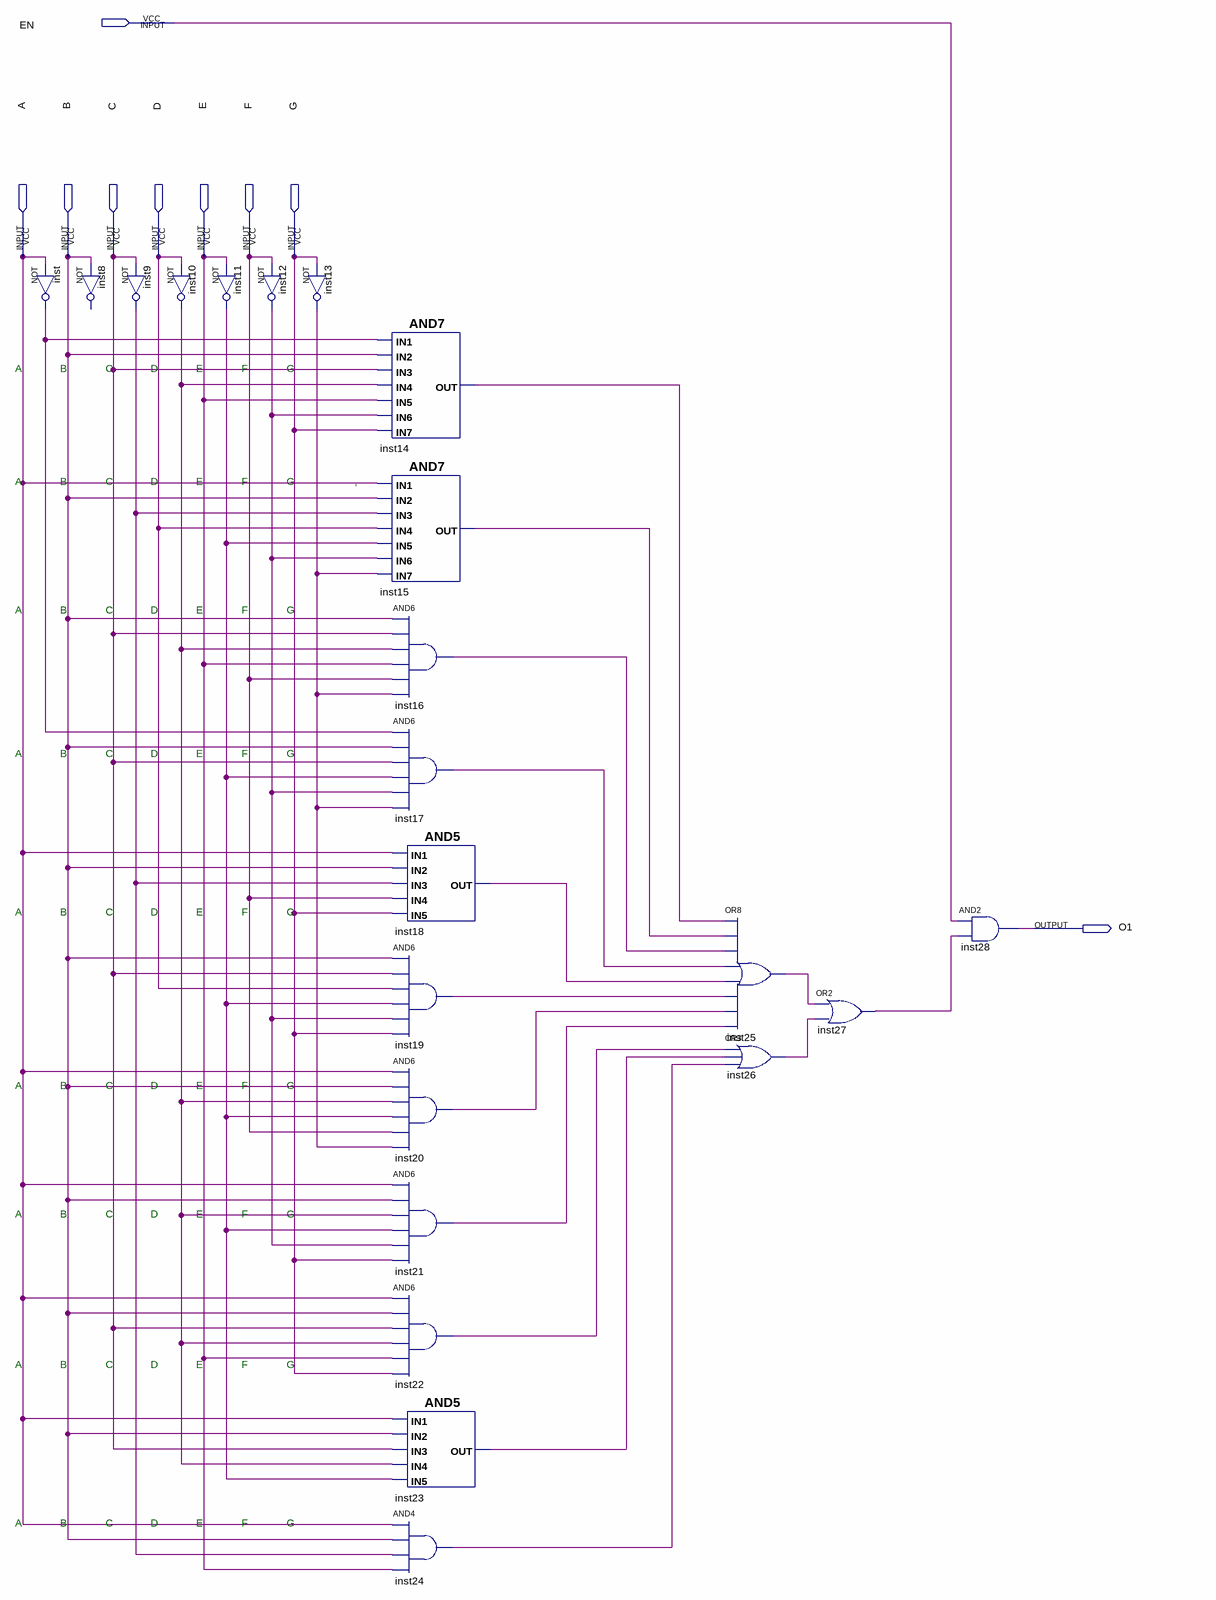
[diagram p0: schematic sheet]
// Quartus schematic linha3led1.bdf as structural Verilog: 22 symbols, 9 pins
module linha3led1 (
  input  EN,
  input  A,
  input  B,
  input  C,
  input  D,
  input  E,
  input  F,
  input  G,
  output O1
);

  wire inst9_out, inst10_out, inst11_out, inst12_out, inst13_out, inst14_out, inst15_out, inst16_out,
       inst17_out, inst18_out, inst19_out, inst20_out, inst21_out, inst22_out, inst23_out, inst24_out,
       inst25_out, inst26_out, inst27_out, inst_out;

  not inst (inst_out, A);
  // NOT inst8 has open pins: IN=B, OUT=open
  not inst9 (inst9_out, C);
  not inst10 (inst10_out, D);
  not inst11 (inst11_out, E);
  not inst12 (inst12_out, F);
  not inst13 (inst13_out, G);
  and inst14 (inst14_out, inst_out, B, C, inst10_out, E, inst12_out, G);
  and inst15 (inst15_out, A, B, inst9_out, D, inst11_out, inst12_out, inst13_out);
  and inst16 (inst16_out, B, C, inst10_out, E, F, inst13_out);
  and inst17 (inst17_out, inst_out, B, C, inst11_out, inst12_out, inst13_out);
  and inst18 (inst18_out, A, B, inst9_out, F, G);
  and inst19 (inst19_out, B, C, D, inst11_out, inst12_out, G);
  and inst20 (inst20_out, A, B, inst10_out, inst11_out, F, inst13_out);
  and inst21 (inst21_out, A, B, inst10_out, inst11_out, inst12_out, G);
  and inst22 (inst22_out, A, B, C, inst10_out, E, G);
  and inst23 (inst23_out, A, B, C, inst10_out, inst11_out);
  and inst24 (inst24_out, A, B, inst9_out, E);
  or inst25 (inst25_out, inst14_out, inst15_out, inst16_out, inst17_out, inst18_out, inst19_out, inst20_out, inst21_out);
  or inst26 (inst26_out, inst22_out, inst23_out, inst24_out);
  or inst27 (inst27_out, inst25_out, inst26_out);
  and inst28 (O1, EN, inst27_out);

  // Notes on the sheet:
  //   A
  //   B
  //   C
  //   D
  //   E
  //   F
  //   G
  //   A
  //   B
  //   C
  //   D
  //   E
  //   F
  //   G
  //   ,
  //   A
  //   B
  //   C
  //   D
  //   E
  //   F
  //   G
  //   A
  //   B
  //   C
  //   D
  //   E
  //   F
  //   G
  //   A
  //   B
  //   C
  //   D
  //   E
  //   F
  //   G
  //   A
  //   B
  //   C
  //   D
  //   E
  //   F
  //   G
  //   A
  //   B
  //   C
  //   D
  //   E
  //   F
  //   G
  //   A
  //   B
  //   C
  //   D
  //   E
  //   F
  //   G
  //   A
  //   B
  //   C
  //   D
  //   E
  //   F
  //   G
endmodule
